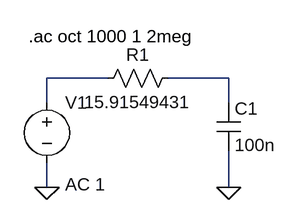
[diagram p0: schematic lpf_1st_ord_100khz_cutoff.asc]
lpf_1st_ord_100khz_cutoff.asc, the LTspice schematic file:
Version 4.1
SHEET 1 880 680
WIRE 144 96 64 96
WIRE 304 96 224 96
WIRE 64 128 64 96
WIRE 304 128 304 96
WIRE 64 240 64 208
WIRE 304 240 304 192
FLAG 304 240 0
FLAG 64 240 0
SYMBOL voltage 64 112 R0
WINDOW 3 24 152 Left 2
WINDOW 123 24 124 Left 2
WINDOW 39 0 0 Left 0
SYMATTR Value ""
SYMATTR Value2 AC 1
SYMATTR InstName V1
SYMBOL res 240 80 R90
WINDOW 0 0 56 VBottom 2
WINDOW 3 32 56 VTop 2
SYMATTR InstName R1
SYMATTR Value 15.91549431
SYMBOL cap 288 128 R0
SYMATTR InstName C1
SYMATTR Value 100n
TEXT 40 40 Left 2 !.ac oct 1000 1 2meg

The netlist it stands for:
* lpf_1st_ord_100khz_cutoff.asc
V1 N001 0 AC 1
R1 N002 N001 15.91549431
C1 N002 0 100n
.ac oct 1000 1 2meg
.backanno
.end